# EAGLE design ThermoPi A (EAGLE 9.0.1)
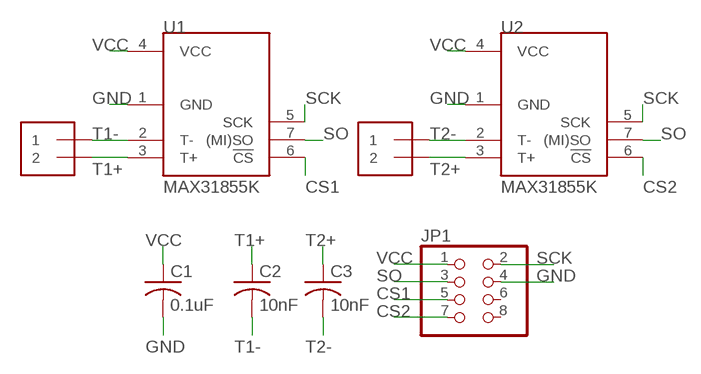
[diagram p0: schematic, sheet 1]

## Parts
C1  0.1uF  C-USC0603  [C0603]
C2  10nF  C-USC0603  [C0603]
C3  10nF  C-USC0603  [C0603]
J1  1X2-3.5MM  [1X2-3.5MM]
J2  1X2-3.5MM  [1X2-3.5MM]
JP1  PINHD-2X4  [2X04]
U1  MAX31855K  [SO08]
U2  MAX31855K  [SO08]

## Nets
CS1: JP1.5 U1.6(!CS)
CS2: JP1.7 U2.6(!CS)
GND: C1.2 JP1.4 U1.1(GND) U2.1(GND)
SCK: JP1.2 U1.5(SCK) U2.5(SCK)
SO: JP1.3 U1.7((MI)SO) U2.7((MI)SO)
T1+: C2.1 J1.2 U1.3(T+)
T1-: C2.2 J1.1 U1.2(T-)
T2+: C3.1 J2.2 U2.3(T+)
T2-: C3.2 J2.1 U2.2(T-)
VCC: C1.1 JP1.1 U1.4(VCC) U2.4(VCC)
Unconnected: JP1.6 JP1.8

## Library data of the parts
C1-C3 = rcl:C-US: CAPACITOR, American symbol; SPICEPREFIX: C
J1 J2 = adafruit:1X2: 3.5mm Terminal block http://www.ladyada.net/library/pcb/eaglelibrary.html
JP1 = adafruit:PINHD-2X4: PIN HEADER
U1 U2 = SparkFun-IC-Conversion:MAX31855K: Cold-Junction-Compensated K-Thermocoupleto-Digital Converter (-270°C to +1800°C) The MAX31855K performs cold-junction compensation and digitizes the signal from a type-K thermocouple. The data is output in a 14-bit resolution, SPI™-compatible, read-only format. This converter resolves temperatures to 0.25°C, allows readings as high as +1800°C and as low as -270°C, and exhibits thermocouple accuracy of ±2°C for temperatures ranging from -200°C to +700°C for K-type thermocouples. Datasheet <https://cdn.sparkfun.com/datasheets/Sensors/Temp/MAX31855K.pdf> SparkFun Products SparkFun Thermocouple Breakout - MAX31855K <https://www.sparkfun.com/products/13266> (SEN-13266); PROD_ID: IC-12578

## Board
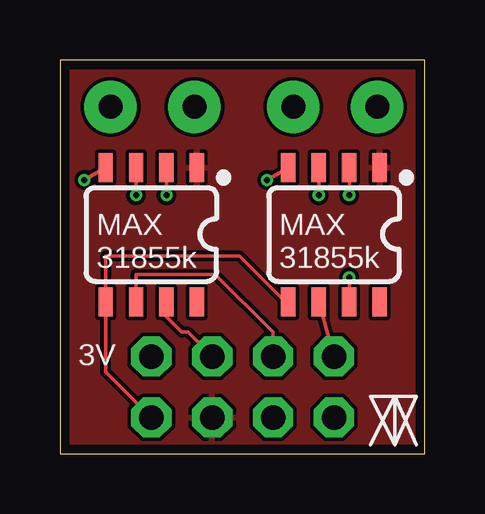
[diagram p1: board, top side]
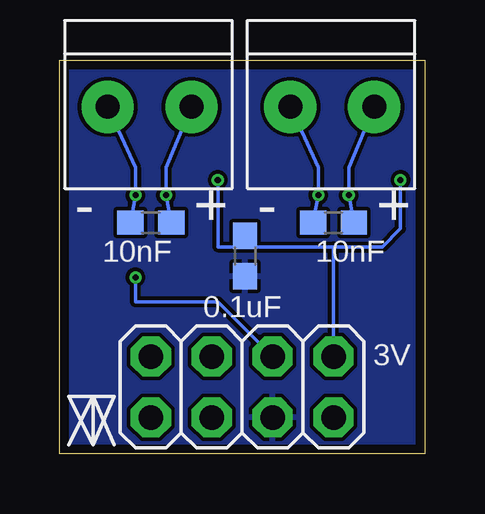
[diagram p2: board, bottom side, seen from below]

Size 15.22 x 16.43 mm. Coordinates in mm from the lower left corner, seen from the top.
Outline: 0,0 15.22,0 15.22,16.43 0,16.43 0,0
Copper layers (1*16): Top 0.035559375mm / dielectric 1.6mm / Bottom 0.035559375mm
Design rules "oshpark-2layer *": minimum track width 6mil, minimum drill 10mil, track to track 6mil, track to pad 6mil, pad to pad 6mil, via to via 6mil, smd to smd 6mil, copper to edge 15mil, drill to drill 6mil, minimum pad ring 5mil, minimum via ring 5mil, stop-mask expansion 2.5mil, vias tented up to drill 15mil, thermal gap 6mil

### Footprints (pad centres in the part's own frame; a part is rotated, then mirrored left to right if it is on the bottom)
C0603 = smd 1.1 x 1: 1 -0.85,0; 2 0.85,0
1X2-3.5MM = drill 1 pad 2.184: 1 1.8,0; 2 -1.7,0
2X04 = drill 1.016 pad 1.676 octagon: 1 -3.81,-1.27; 2 -3.81,1.27; 3 -1.27,-1.27; 4 -1.27,1.27; 5 1.27,-1.27; 6 1.27,1.27; 7 3.81,-1.27; 8 3.81,1.27
SO08 = smd 0.6 x 1.2: 1 -1.905,-2.8; 2 -0.635,-2.8; 3 0.635,-2.8; 4 1.905,-2.8; 5 1.905,2.8; 6 0.635,2.8; 7 -0.635,2.8; 8 -1.905,2.8

### Placement (x,y rotation side)
C1  7.49,8.26 270 bottom
C2  3.81,9.65 180 bottom
C3  11.43,9.65 180 bottom
J1  3.81,14.48 180 bottom
J2  11.43,14.48 180 bottom
JP1  7.62,2.79 180 bottom
U1  3.81,9.14 180 top
U2  11.43,9.14 180 top

### Tracks (layer width: path | path; a pad name or v marks a point on that pad's centre or on a via)
CS1
  Top 0.152: U1.6 3.17,7.49 6.48,7.49 8.89,5.08 JP1.5
CS2
  Top 0.152: JP1.7 U2.6
GND
  pour Top (rank 6): -2.54,19.05 17.78,19.05 17.78,-2.29 -2.54,-2.29
  pour Bottom (rank 6): 19.05,18.03 -1.27,18.03 -1.27,-3.81 19.05,-3.81
SCK
  Top 0.152: U2.5 9.4,6.35 7.49,8.26 1.91,8.26 U1.5 1.91,3.43 JP1.2
SO  (via drill 0.25)
  Top 0.152: JP1.3 5.33,5.08 5.08,5.08 4.45,5.71 U1.7 | v12.06,7.37 U2.7
  Bottom 0.152: JP1.3 8.64,6.35 U2.7 v12.06,7.37
T1+  (via drill 0.25)
  Top 0.152: v3.17,10.79 U1.3
  Bottom 0.152: C2.1 v3.17,10.79 U1.3 J1.2
T1-  (via drill 0.25)
  Top 0.152: v4.45,10.79 U1.2
  Bottom 0.152: C2.2 v4.45,10.79 U1.2 J1.1
T2+  (via drill 0.25)
  Top 0.152: v10.79,10.79 U2.3
  Bottom 0.152: C3.1 v10.79,10.79 U2.3 J2.2
T2-  (via drill 0.25)
  Top 0.152: v12.06,10.79 U2.2
  Bottom 0.152: C3.2 v12.06,10.79 U2.2 J2.1
VCC  (via drill 0.25)
  Top 0.152: v8.64,11.43 U2.4 | v1.02,11.43 U1.4
  Bottom 0.152: v8.64,11.43 8.64,8.64 7.49,8.64 | 7.49,8.64 3.81,8.64 | 3.81,8.64 1.78,8.64 1.02,9.4 v1.02,11.43 | C1.1 7.49,8.64 | JP1.1 3.81,8.64

### Text on the board
tPlace: MAX / 31855k | MAX / 31855k | 3V
bPlace: + | - | + | - | 10nF | 10nF | 0.1uF | 3V